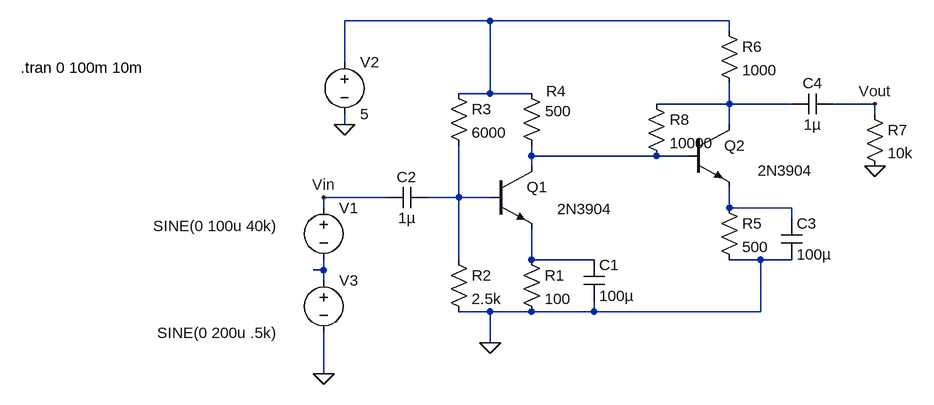
[diagram p0: schematic amplifier_circuit_input.asc]
amplifier_circuit_input.asc, the LTspice schematic file:
Version 4
SHEET 1 880 680
WIRE 144 -112 -80 -112
WIRE 512 -112 144 -112
WIRE 512 -96 512 -112
WIRE -80 -48 -80 -112
WIRE 144 0 144 -112
WIRE 144 0 96 0
WIRE 208 0 144 0
WIRE 512 16 512 -16
WIRE 512 16 400 16
WIRE 608 16 512 16
WIRE 736 16 672 16
WIRE 736 32 736 16
WIRE -80 48 -80 32
WIRE 512 48 512 16
WIRE 208 96 208 80
WIRE 400 96 208 96
WIRE 448 96 400 96
WIRE 208 112 208 96
WIRE -16 160 -112 160
WIRE 96 160 96 80
WIRE 96 160 48 160
WIRE 144 160 96 160
WIRE -112 176 -112 160
WIRE 512 176 512 144
WIRE 608 176 512 176
WIRE 608 192 608 176
WIRE 96 256 96 160
WIRE 208 256 208 208
WIRE 304 256 208 256
WIRE 560 256 512 256
WIRE 608 256 560 256
WIRE -112 272 -112 256
WIRE -112 272 -128 272
WIRE -112 288 -112 272
WIRE 144 336 96 336
WIRE 208 336 144 336
WIRE 304 336 304 320
WIRE 304 336 208 336
WIRE 560 336 560 256
WIRE 560 336 304 336
WIRE 144 384 144 336
WIRE -112 432 -112 368
FLAG 144 384 0
FLAG -80 48 0
FLAG -112 160 Vin
FLAG 736 112 0
FLAG 736 16 Vout
FLAG -112 432 0
SYMBOL npn 144 112 R0
WINDOW 3 103 66 Left 2
SYMATTR InstName Q1
SYMATTR Value 2N3904
SYMBOL res 192 240 R0
SYMATTR InstName R1
SYMATTR Value 100
SYMBOL res 80 240 R0
SYMATTR InstName R2
SYMATTR Value 2.5k
SYMBOL res 80 -16 R0
SYMATTR InstName R3
SYMATTR Value 6000
SYMBOL res 192 -16 R0
WINDOW 0 38 12 Left 2
WINDOW 3 37 43 Left 2
SYMATTR InstName R4
SYMATTR Value 500
SYMBOL cap 288 256 R0
SYMATTR InstName C1
SYMATTR Value 100µ
SYMBOL cap 48 144 R90
WINDOW 0 0 32 VBottom 2
WINDOW 3 32 32 VTop 2
SYMATTR InstName C2
SYMATTR Value 1µ
SYMBOL voltage -112 160 R0
WINDOW 3 -262 44 Left 2
WINDOW 123 0 0 Left 2
WINDOW 39 0 0 Left 2
SYMATTR InstName V1
SYMATTR Value SINE(0 100u 40k)
SYMBOL voltage -80 -64 R0
WINDOW 123 0 0 Left 2
WINDOW 39 0 0 Left 2
SYMATTR InstName V2
SYMATTR Value 5
SYMBOL npn 448 48 R0
WINDOW 3 108 71 Left 2
SYMATTR InstName Q2
SYMATTR Value 2N3904
SYMBOL res 496 160 R0
SYMATTR InstName R5
SYMATTR Value 500
SYMBOL res 496 -112 R0
SYMATTR InstName R6
SYMATTR Value 1000
SYMBOL cap 592 192 R0
SYMATTR InstName C3
SYMATTR Value 100µ
SYMBOL res 720 16 R0
SYMATTR InstName R7
SYMATTR Value 10k
SYMBOL cap 672 0 R90
WINDOW 0 0 32 VBottom 2
WINDOW 3 32 32 VTop 2
SYMATTR InstName C4
SYMATTR Value 1µ
SYMBOL voltage -112 272 R0
WINDOW 3 -256 97 Left 2
WINDOW 123 0 0 Left 2
WINDOW 39 0 0 Left 2
SYMATTR InstName V3
SYMATTR Value SINE(0 200u .5k)
SYMBOL res 384 0 R0
SYMATTR InstName R8
SYMATTR Value 10000
TEXT -578 -40 Left 2 !.tran 0 100m 10m

The netlist it stands for:
* amplifier_circuit_input.asc
Q1 N003 N004 N006 0 2N3904
R1 N006 0 100
R2 N004 0 2.5k
R3 N001 N004 6000
R4 N001 N003 500
C1 N006 0 100µ
C2 N004 Vin 1µ
V1 Vin N007 SINE(0 100u 40k)
V2 N001 0 5
Q2 N002 N003 N005 0 2N3904
R5 N005 0 500
R6 N001 N002 1000
C3 N005 0 100µ
R7 Vout 0 10k
C4 Vout N002 1µ
V3 N007 0 SINE(0 200u .5k)
R8 N002 N003 10000
.model NPN NPN
.model PNP PNP
.lib standard.bjt
.tran 0 100m 10m
.backanno
.end